# Altium schematic sheet Voltage Regulator.SchDoc: Voltage Regulator
size A4; Author: Jason Zhou; Engineer: Jason Zhou; Revision: 1; SheetNumber: 2; SheetTotal: 5; Projectidentifier: V5 Coprocessor; SPICEModelCacheAZWFLMOM: <root> / <DocumentId>AZWFLMOM</DocumentId> / </root>
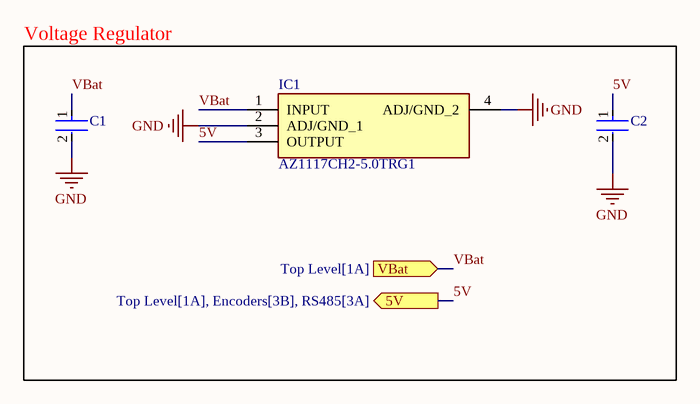
[diagram p0: Voltage Regulator.SchDoc]

## Parts
C1  CL31A106MAHNNNE  [FP-CL31-IPC_B]  (value not drawn)
C2  CL31A226MOCLNNC  [FP-CL31-IPC_A]  (value not drawn)
IC1  AZ1117CH2-5.0TRG1  [SOT230P700X180-4N]

## Blocks framed on the sheet
Voltage Regulator: C1 C2 IC1

## Ports
5V (out, see Top Level[1A], Encoders[3B], RS485[3A]), VBat (in, see Top Level[1A])

## Nets
GND: C1.2 C2.2 IC1.2(ADJ/GND_1) IC1.4(ADJ/GND_2)
5V: C2.1 IC1.3(OUTPUT) ; port 5V
VBat: C1.1 IC1.1(INPUT) ; port VBat

## Notes on the sheet
- Size:
- Date:
- Title
- A4
- Project:
- Time:
- Revision:
- Sheet
- of
- Engineer
- File:

## Library data of the parts
C1 = CMP-13271-000714-1: Cap Ceramic 10uF 25V X5R ±20% SMD 1206 +85°C Embossed T/R; Depth: 1.6mm; Length: 3.2mm; Thickness: 0.071inch; Voltage Rating: 25V; Width: 0.063inch; Mount: Surface Mount; Height: 1.6mm; Dielectric: X5R; Case Code (Metric): 3216; Case/Package: 1206; Radiation Hardening: No; Lead Free: Lead Free; Min Operating Temperature: -55°C; Tolerance: 20%; Voltage Rating (DC): 25V; Packaging: Tape and Reel; Capacitance: 10uF; Case Code (Imperial): 1206; Max Operating Temperature: 85°C
C2 = CMP-13271-002013-1: Cap Ceramic 22uF 16V X5R ±20% SMD 1206 +85°C Embossed T/R; Height: 0.85mm; Min Operating Temperature: -55°C; Thickness: 0.037inch; Depth: 1.6mm; Length: 3.2mm; Tolerance: 20%; Case Code (Imperial): 1206; Capacitance: 22uF; Package Quantity: 1; Radiation Hardening: No; Case/Package: 1206; Dielectric: X5R; Packaging: Tape and Reel; Voltage: 16V; Case Code (Metric): 3216; Width: 0.063inch; Lead Free: Lead Free; Mount: Surface Mount; Voltage Rating: 16V; Max Operating Temperature: 85°C
IC1 = AZ1117CH2-5.0TRG1: Integrated Circuit; Manufacturer_Name: Diodes Incorporated; Datasheet Link: https://www.arrow.com/en/products/az1117ch2-5.0trg1/diodes-incorporated; Height: 1.8mm; Manufacturer_Part_Number: AZ1117CH2-5.0TRG1; Mouser Part Number: 621-AZ1117CH2-5.0TRG; Mouser Price/Stock: https://www.mouser.co.uk/ProductDetail/Diodes-Incorporated/AZ1117CH2-5.0TRG1?qs=5V6w%252Be2aIqb578qtLdqPjw%3D%3D; Arrow Part Number: AZ1117CH2-5.0TRG1; Arrow Price/Stock: https://www.arrow.com/en/products/az1117ch2-5.0trg1/diodes-incorporated